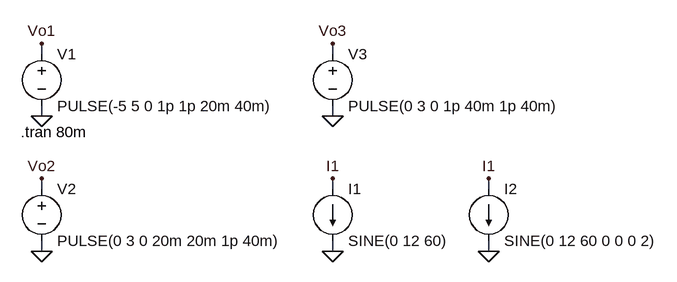
[diagram p0: schematic voltageAndCurrentSources.asc]
voltageAndCurrentSources.asc, the LTspice schematic file:
Version 4
SHEET 1 1080 680
WIRE 112 128 112 112
WIRE 560 128 560 112
WIRE 112 224 112 208
WIRE 560 224 560 208
WIRE 112 336 112 320
WIRE 560 336 560 320
WIRE 800 336 800 320
WIRE 112 432 112 416
WIRE 560 432 560 416
WIRE 800 432 800 416
FLAG 112 224 0
FLAG 112 112 Vo1
FLAG 112 432 0
FLAG 112 320 Vo2
FLAG 560 224 0
FLAG 560 112 Vo3
FLAG 560 432 0
FLAG 560 320 I1
FLAG 800 432 0
FLAG 800 320 I1
SYMBOL voltage 112 112 R0
WINDOW 123 0 0 Left 0
WINDOW 39 0 0 Left 0
SYMATTR InstName V1
SYMATTR Value PULSE(-5 5 0 1p 1p 20m 40m)
SYMBOL voltage 112 320 R0
WINDOW 123 0 0 Left 0
WINDOW 39 0 0 Left 0
SYMATTR InstName V2
SYMATTR Value PULSE(0 3 0 20m 20m 1p 40m)
SYMBOL voltage 560 112 R0
WINDOW 123 0 0 Left 0
WINDOW 39 0 0 Left 0
SYMATTR InstName V3
SYMATTR Value PULSE(0 3 0 1p 40m 1p 40m)
SYMBOL current 560 336 R0
WINDOW 123 0 0 Left 0
WINDOW 39 0 0 Left 0
SYMATTR InstName I1
SYMATTR Value SINE(0 12 60)
SYMBOL current 800 336 R0
WINDOW 123 0 0 Left 0
WINDOW 39 0 0 Left 0
SYMATTR InstName I2
SYMATTR Value SINE(0 12 60 0 0 0 2)
TEXT 80 248 Left 2 !.tran 80m

The netlist it stands for:
* voltageAndCurrentSources.asc
V1 Vo1 0 PULSE(-5 5 0 1p 1p 20m 40m)
V2 Vo2 0 PULSE(0 3 0 20m 20m 1p 40m)
V3 Vo3 0 PULSE(0 3 0 1p 40m 1p 40m)
I1 I1 0 SINE(0 12 60)
I2 I1 0 SINE(0 12 60 0 0 0 2)
.tran 80m
.backanno
.end